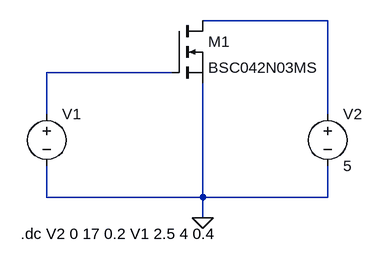
[diagram p0: schematic lab3_task2.asc]
lab3_task2.asc, the LTspice schematic file:
Version 4
SHEET 1 880 680
WIRE 576 48 384 48
WIRE 336 128 144 128
WIRE 144 192 144 128
WIRE 576 192 576 48
WIRE 144 320 144 272
WIRE 384 320 384 144
WIRE 384 320 144 320
WIRE 576 320 576 272
WIRE 576 320 384 320
WIRE 384 352 384 320
FLAG 384 352 0
SYMBOL voltage 144 176 R0
SYMATTR InstName V1
SYMATTR Value ""
SYMBOL voltage 576 176 R0
SYMATTR InstName V2
SYMATTR Value 5
SYMBOL nmos 336 48 R0
SYMATTR InstName M1
SYMATTR Value BSC042N03MS
TEXT 104 376 Left 2 !.dc V2 0 17 0.2 V1 2.5 4 0.4

The netlist it stands for:
* lab3_task2.asc
V1 N002 0
V2 N001 0 5
M1 N001 N002 0 0 BSC042N03MS
.model NMOS NMOS
.model PMOS PMOS
.lib standard.mos
.dc V2 0 17 0.2 V1 2.5 4 0.4
.backanno
.end